# EAGLE design prototype_v02 (EAGLE 5.07)
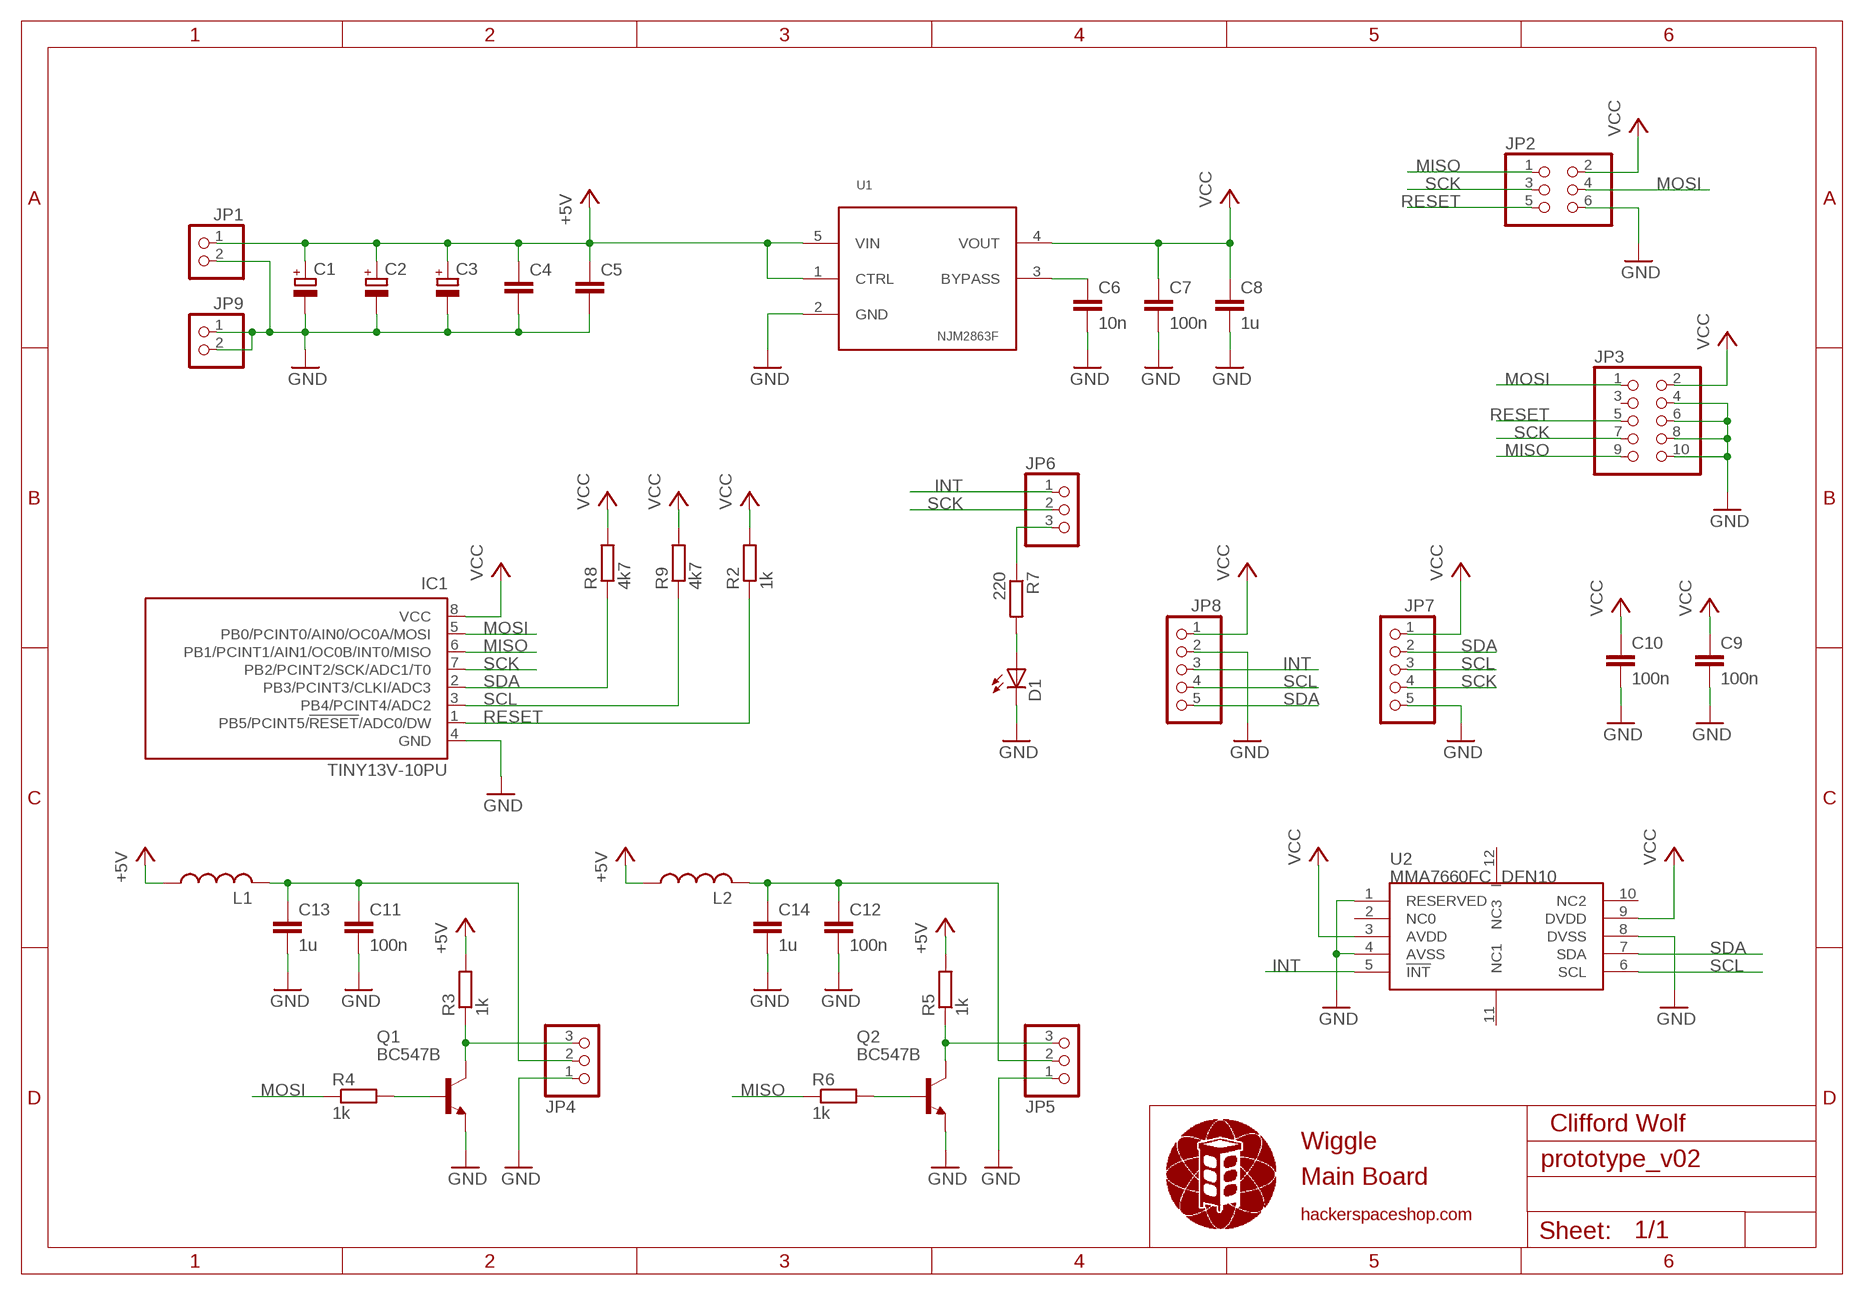
[diagram p0: schematic, sheet 1]

## Parts
C1  CPOLE5-10.5  [E5-10,5]
C2  CPOLE2-5  [E2-5]
C3  CPOLE2-5  [E2-5]
C4  C050-030X075  [C050-030X075]
C5  C050-030X075  [C050-030X075]
C6  10n  C050-030X075  [C050-030X075]
C7  100n  C050-030X075  [C050-030X075]
C8  1u  C050-030X075  [C050-030X075]
C9  100n  C050-030X075  [C050-030X075]
C10  100n  C050-030X075  [C050-030X075]
C11  100n  C050-030X075  [C050-030X075]
C12  100n  C050-030X075  [C050-030X075]
C13  1u  C050-030X075  [C050-030X075]
C14  1u  C050-030X075  [C050-030X075]
D1  LED5MM  [LED5MM]
IC1  TINY13V-10PU  [DIL08]
JP1  PINHD-1X2/90  [1X02/90]
JP2  PINHD-2X3  [2X03]
JP3  TC2050-IDC-NLTC2050-IDC-NL  [TC2050-IDC-NL]
JP4  PINHD-1X3/90  [1X03/90]
JP5  PINHD-1X3/90  [1X03/90]
JP6  PINHD-1X3  [1X03]
JP7  PINHD-1X5  [1X05]
JP8  PINHD-1X5  [1X05]
JP9  PINHD-1X2  [1X02]
L1  L0414/15  [0414/15]
L2  L0414/15  [0414/15]
Q1  BC547B  [TO92]
Q2  BC547B  [TO92]
R2  1k  R0309/10  [0309/10]
R3  1k  R0309/10  [0309/10]
R4  1k  R0309/10  [0309/10]
R5  1k  R0309/10  [0309/10]
R6  1k  R0309/10  [0309/10]
R7  220  R0309/10  [0309/10]
R8  4k7  R0309/10  [0309/10]
R9  4k7  R0309/10  [0309/10]
U1  NJM2863F  [SOT23-5L]
U2  MMA7660FC_DFN10  [DFN10]

## Nets
+5V [pwr]: C1.+ C2.+ C3.+ C4.1 C5.1 JP1.1 L1.1 L2.1 R3.2 R5.2 U1.1(CTRL) U1.5(VIN)
GND [pwr]: C1.- C2.- C3.- C4.2 C5.2 C6.2 C7.2 C8.2 C9.2 C10.2 C11.2 C12.2 C13.2 C14.2 D1.K(C) IC1.4(GND) JP1.2 JP2.6 JP3.4 JP3.6 JP3.8 JP3.10 JP4.1 JP5.1 JP7.5 JP8.2 JP9.1 JP9.2 Q1.1(E) Q2.1(E) U1.2(GND) U2.1(RESERVED) U2.4(AVSS) U2.8(DVSS)
INT: JP6.1 JP8.3 U2.5(!INT)
MISO: IC1.6(PB1/PCINT1/AIN1/OC0B/INT0/MISO) JP2.1 JP3.9 R6.1
MOSI: IC1.5(PB0/PCINT0/AIN0/OC0A/MOSI) JP2.4 JP3.1 R4.1
N$1: JP4.3 Q1.3(C) R3.1
N$2: Q1.2(B) R4.2
N$4: C6.1 U1.3(BYPASS)
N$5: D1.A R7.2
N$6: JP6.3 R7.1
N$7: JP5.3 Q2.3(C) R5.1
N$8 [pwr]: C11.1 C13.1 JP4.2 L1.2
N$9 [pwr]: C12.1 C14.1 JP5.2 L2.2
N$10: Q2.2(B) R6.2
RESET: IC1.1(PB5/PCINT5/!RESET!/ADC0/DW) JP2.5 JP3.5 R2.1
SCK: IC1.7(PB2/PCINT2/SCK/ADC1/T0) JP2.3 JP3.7 JP6.2 JP7.4
SCL: IC1.3(PB4/PCINT4/ADC2) JP7.3 JP8.4 R9.1 U2.6(SCL)
SDA: IC1.2(PB3/PCINT3/CLKI/ADC3) JP7.2 JP8.5 R8.1 U2.7(SDA)
VCC [pwr]: C7.1 C8.1 C9.1 C10.1 IC1.8(VCC) JP2.2 JP3.2 JP7.1 JP8.1 R2.2 R8.2 R9.2 U1.4(VOUT) U2.3(AVDD) U2.9(DVDD)
Unconnected: JP3.3 U2.2(NC0) U2.10(NC2) U2.11(NC1) U2.12(NC3)

## Notes on the sheet
- Clifford Wolf
- Wiggle
- Main Board
- hackerspaceshop.com

## Library data of the parts
C1-C3 = mp_passive:CPOL: POLARIZED CAPACITOR, European symbol
C4-C14 = mp_passive:C: CAPACITOR, European symbol
D1 = mp_diode:LED: LED (5mm)
IC1 = parts:TINY13: 8-bit AVR Microcontroller with 1K Bytes In-System Programmable Flash Source: http://www.atmel.com/dyn/resources/prod_documents/2535S.pdf
JP1 = parts:PINHD-1X2: PIN HEADER
JP2 = parts:PINHD-2X3: PIN HEADER
JP3 = parts:TC2050-IDC-NL: PIN HEADER
JP4-JP6 = mpc_pinhead:PINHD-1X3: PIN HEADER
JP7 JP8 = mpc_pinhead:PINHD-1X5: PIN HEADER
JP9 = mpc_pinhead:PINHD-1X2: PIN HEADER
L1 L2 = mp_passive:L: INDUCTOR, American symbol
Q1 Q2 = mp_transistor:BC547B: NPN Transistor
R2-R9 = mp_passive:R: RESISTOR, European symbol
U1 = parts:NJM2863F
U2 = ICs_v54:MMA7660FC

## Net classes
1 pwr: width 0.254 mm

## Board
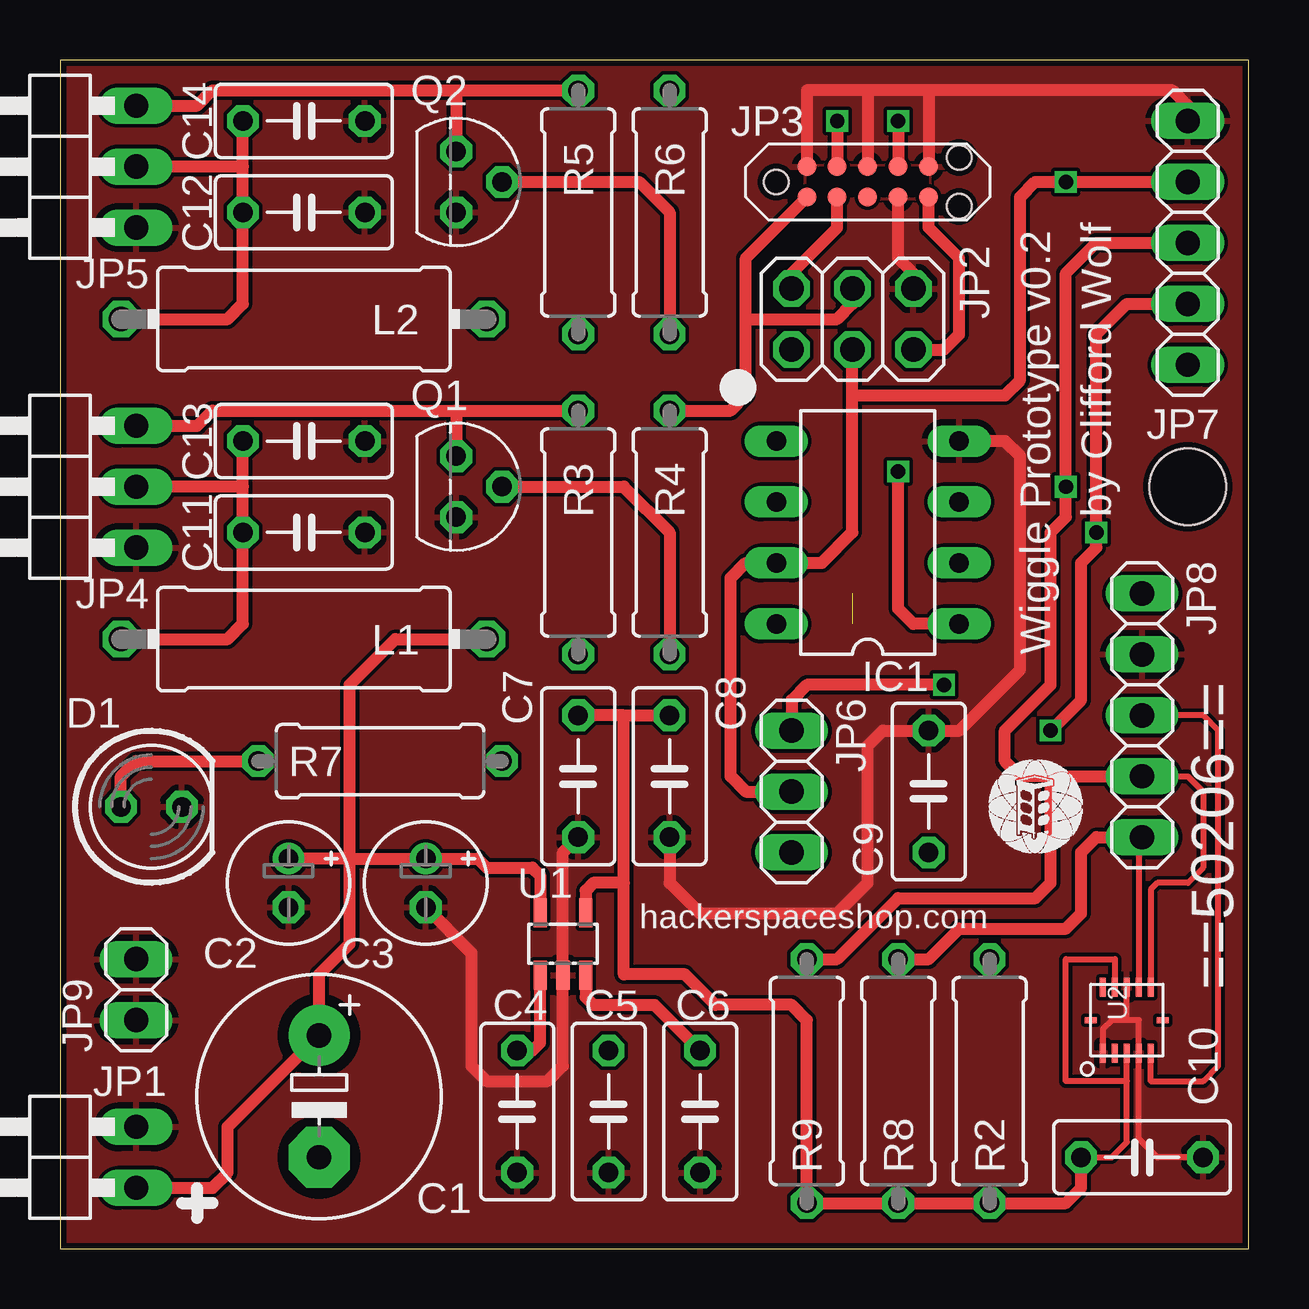
[diagram p1: board, top side]
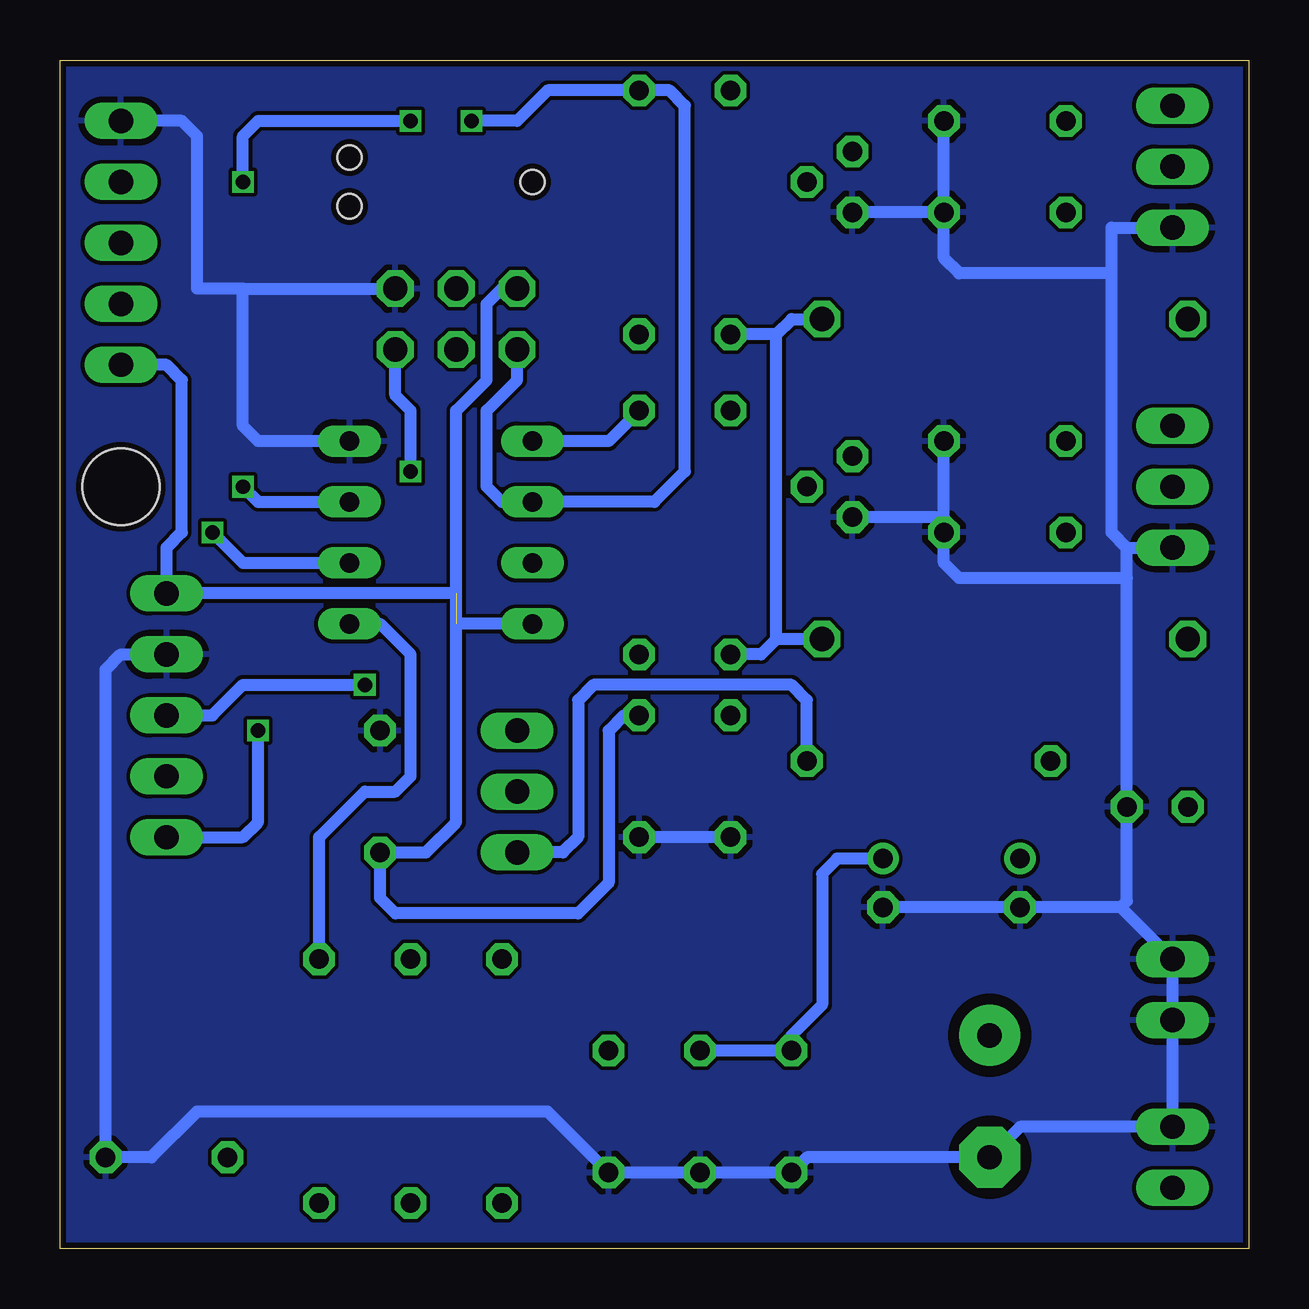
[diagram p2: board, bottom side, seen from below]

Size 49.53 x 49.53 mm. Coordinates in mm from the lower left corner, seen from the top.
Outline: 0,0 49.53,0 49.53,49.53 0,49.53 0,0
Copper layers (1*16): Top 0.035mm / dielectric 1.5mm / Bottom 0.035mm
Design rules "seeed": minimum track width 6mil, minimum drill 12mil, track to track 6mil, track to pad 6mil, pad to pad 6mil, via to via 6mil, smd to smd 0mil, copper to edge 10mil, drill to drill 10mil, minimum pad ring 10mil, minimum via ring 6mil, stop-mask expansion 2mil, vias tented up to drill 100mil, thermal gap 10mil
Holes 3.2 mm at 46.99,31.75
tRestrict: area 9.4,7.5 to 12.2,10.3; area 9.4,2.4 to 12.2,5.2
bRestrict: area 9.4,7.5 to 12.2,10.3; area 9.4,2.4 to 12.2,5.2

### Footprints (pad centres in the part's own frame; a part is rotated, then mirrored left to right if it is on the bottom)
E5-10,5 = drill 1.016 pad 2.54 round: + -2.54,0 | drill 1.016 pad 2.54 octagon: - 2.54,0
E2-5 = drill 0.813 pad 1.27 round: + -1.016,0 | drill 0.813 pad 1.27 octagon: - 1.016,0
C050-030X075 = drill 0.813 octagon: 1 -2.54,0; 2 2.54,0
LED5MM = drill 0.813 octagon: A -1.27,0; K 1.27,0
DIL08 = drill 0.813 long: 1 -3.81,-3.81; 2 -1.27,-3.81; 3 1.27,-3.81; 4 3.81,-3.81; 5 3.81,3.81; 6 1.27,3.81; 7 -1.27,3.81; 8 -3.81,3.81
1X02/90 = drill 1.016 long: 1 -1.27,-3.81; 2 1.27,-3.81
2X03 = drill 1.016 octagon: 1 -2.54,-1.27; 2 -2.54,1.27; 3 0,-1.27; 4 0,1.27; 5 2.54,-1.27; 6 2.54,1.27
TC2050-IDC-NL = smd 0.787 x 0.787: 1 1.27,-0.635; 2 2.54,-0.635; 3 3.81,-0.635; 4 5.08,-0.635; 5 6.35,-0.635; 6 6.35,0.635; 7 5.08,0.635; 8 3.81,0.635; 9 2.54,0.635; 10 1.27,0.635 | hole 1.016: 0,0; 7.62,1.016; 7.62,-1.016
1X03/90 = drill 1.016 long: 1 -2.54,-3.81; 2 0,-3.81; 3 2.54,-3.81
1X03 = drill 1.016 long: 1 -2.54,0; 2 0,0; 3 2.54,0
1X05 = drill 1.016 long: 1 -5.08,0; 2 -2.54,0; 3 0,0; 4 2.54,0; 5 5.08,0
1X02 = drill 1.016 long: 1 -1.27,0; 2 1.27,0
0414/15 = drill 1.016 octagon: 1 -7.62,0; 2 7.62,0
TO92 = drill 0.813 octagon: 1 1.27,0; 2 0,1.905; 3 -1.27,0
0309/10 = drill 0.813 octagon: 1 -5.08,0; 2 5.08,0
SOT23-5L = smd 0.55 x 1.2: 1 -0.95,-1.3; 2 0,-1.3; 3 0.95,-1.3; 4 0.95,1.3; 5 -0.95,1.3
DFN10 = smd 0.8 x 0.25: 1 -1.375,1; 2 -1.375,0.5; 3 -1.375,0; 4 -1.375,-0.5; 5 -1.375,-1; 6 1.375,-1; 7 1.375,-0.5; 8 1.375,0; 9 1.375,0.5; 10 1.375,1 | smd 0.25 x 0.5: 11 0,-1.5; 12 0,1.5

### Placement (x,y rotation side)
C1  10.79,6.35 270 top
C2  9.53,15.24 270 top
C3  15.24,15.24 270 top
C4  19.05,5.71 270 top
C5  22.86,5.71 270 top
C6  26.67,5.71 270 top
C7  21.59,19.68 270 top
C8  25.4,19.68 270 top
C9  36.2,19.05 90 top
C10  45.09,3.81 0 top
C11  10.16,29.84 0 top
C12  10.16,43.18 0 top
C13  10.16,33.66 0 top
C14  10.16,46.99 0 top
D1  3.81,18.41 0 top
IC1  33.66,29.84 90 top
JP1  -0.64,3.81 90 top
JP2  33.02,38.73 0 top
JP3  29.84,44.45 0 top
JP4  -0.64,31.75 90 top
JP5  -0.64,45.09 90 top
JP6  30.48,19.05 270 top
JP7  46.99,41.91 90 top
JP8  45.09,22.23 270 top
JP9  3.17,10.79 90 top
L1  10.16,25.4 180 top
L2  10.16,38.73 180 top
Q1  16.51,31.75 270 top
Q2  16.51,44.45 270 top
R2  38.73,6.99 270 top
R3  21.59,29.84 270 top
R4  25.4,29.84 270 top
R5  21.59,43.18 270 top
R6  25.4,43.18 270 top
R7  13.34,20.32 180 top
R8  34.92,6.99 270 top
R9  31.11,6.99 270 top
U1  20.95,12.7 0 top
U2  44.45,9.53 90 top
U$1  [METALAB]  40.64,18.41 0 top

### Tracks (layer width: path | path; a pad name or v marks a point on that pad's centre or on a via)
+5V
  Top 0.508: JP1.1 6.35,2.54 6.99,3.17 6.99,5.08 C1.+ 10.79,11.43 12.06,12.7 12.06,16.26 | 12.06,16.26 C2.+ | 12.06,16.26 C3.+ 17.4,16.26 17.78,15.88 19.68,15.88 20,15.55 U1.5 | C4.1 19.68,8.26 20,8.57 U1.1 | L1.1 13.97,25.4 12.06,23.5 12.06,16.26
  Bottom 0.508: C3.+ 17.14,16.26 17.78,15.62 17.78,10.16 19.05,8.89 C4.1 C5.1 | 19.68,38.1 R5.2 | L2.1 19.05,38.73 19.68,38.1 | R3.2 20.32,24.77 19.68,25.4 | 19.68,25.4 19.68,38.1 | L1.1 19.68,25.4
GND
  Top 0.254: U2.1 43.45,9.16 43.81,9.53 44.45,9.53 | 44.45,9.53 U2.8 | 44.45,9.53 44.95,9.53 U2.4 44.95,4.58 45.72,3.81 C10.2
  Top 0.508: C3.- 17.14,12.32 17.14,7.62 17.78,6.99 20.32,6.99 20.95,7.62 U1.2 20.95,16.51 C7.2 | C8.2 25.4,15.24 26.67,13.97 32.38,13.97 33.66,15.24 33.66,20.95 34.29,21.59 C9.2 37.47,21.59 40.01,24.13 40.01,33.02 39.37,33.66 IC1.4 | 36.2,48.26 JP3.6 | 36.2,48.26 46.35,48.26 46.99,47.62 JP7.5 | JP3.10 31.11,48.26 33.66,48.26 | 36.2,48.26 33.66,48.26 | 33.66,48.26 JP3.8 | JP3.4 34.92,41.27 35.56,40.64 JP2.6
  Bottom 0.508: 5.33,14.22 JP9.2 JP9.1 JP1.2 9.53,5.08 C1.- 18.41,3.81 C4.2 C5.2 C6.2 29.21,5.71 43.81,5.71 45.72,3.81 C10.2 47.62,24.13 46.99,24.77 JP8.2 | 5.33,14.22 C2.- C3.- | 5.33,14.22 5.08,14.48 D1.K 5.08,27.94 | 5.08,27.94 5.08,29.21 | 5.08,29.21 JP4.1 | 12.7,30.48 Q1.1 | JP5.1 5.71,42.55 5.71,40.64 | 5.08,29.21 5.71,29.84 5.71,40.64 | 5.71,40.64 12.06,40.64 12.7,41.27 C12.2 | C12.2 C14.2 | C12.2 Q2.1 | 5.08,27.94 12.06,27.94 12.7,28.57 C11.2 12.7,30.48 | 12.7,30.48 C13.2 | C7.2 C8.2 | JP7.5 44.45,46.99 43.81,46.35 43.81,40.01 41.91,40.01 | 41.91,40.01 41.91,34.29 41.27,33.66 IC1.4 | 41.91,40.01 JP2.6
  pour Top: 0,49.53 49.53,49.53 49.53,0 0,0
  pour Bottom: 0,49.53 0,0 49.53,0 49.53,49.53
INT  (via drill 0.6)
  Top 0.254: U2.5 45.45,6.99 47.62,6.99 48.26,7.62 48.26,21.59 47.62,22.23 JP8.3
  Top 0.508: v36.83,23.5 31.11,23.5 30.48,22.86 JP6.1
  Bottom 0.508: v36.83,23.5 41.91,23.5 43.18,22.23 JP8.3
MISO  (via drill 0.6)
  Top 0.508: v32.38,46.99 JP3.9
  Bottom 0.508: v32.38,46.99 30.48,46.99 29.21,48.26 R6.1 24.13,48.26 23.5,47.62 23.5,32.38 24.77,31.11 IC1.6 31.11,31.11 31.75,31.75 31.75,34.92 30.48,36.2 JP2.1
MOSI
  Top 0.508: JP2.4 33.02,39.37 32.38,38.73 28.57,38.73 | 28.57,38.73 28.57,41.27 JP3.1 | 28.57,38.73 28.57,35.56 27.94,34.92 R4.1
  Bottom 0.508: IC1.5 26.67,33.66 R4.1
N$1
  Top 0.508: JP4.3 5.71,34.29 6.35,34.92 16.51,34.92 | 16.51,34.92 R3.1 | 16.51,34.92 Q1.3
N$2
  Top 0.508: Q1.2 23.5,31.75 25.4,29.84 R4.2
N$4
  Top 0.508: U1.3 21.91,10.48 22.23,10.16 24.77,10.16 C6.1
N$5
  Top 0.508: D1.A 2.54,19.68 3.17,20.32 R7.2
N$6
  Bottom 0.508: JP6.3 28.57,16.51 27.94,17.14 27.94,22.86 27.3,23.5 19.05,23.5 18.41,22.86 R7.1
N$7
  Top 0.508: JP5.3 5.71,47.62 6.35,48.26 16.51,48.26 | 16.51,48.26 R5.1 | 16.51,48.26 Q2.3
N$8
  Top 0.508: 7.62,31.75 C11.1 7.62,26.04 6.99,25.4 L1.2 | 7.62,31.75 C13.1 | 7.62,31.75 JP4.2
N$9
  Top 0.508: L2.2 6.99,38.73 7.62,39.37 C12.1 7.62,45.09 | 7.62,45.09 C14.1 | 7.62,45.09 JP5.2
N$10
  Top 0.508: Q2.2 24.13,44.45 25.4,43.18 R6.2
RESET  (via drill 0.6)
  Top 0.508: JP3.5 36.2,42.55 37.47,41.27 37.47,38.1 36.83,37.47 JP2.5 | v34.92,32.38 34.92,26.67 35.56,26.04 IC1.1
  Bottom 0.508: R2.1 38.73,17.14 36.83,19.05 35.56,19.05 34.92,19.68 34.92,24.77 36.2,26.04 IC1.1 | JP2.5 35.56,35.56 34.92,34.92 v34.92,32.38
SCK  (via drill 0.6)
  Top 0.508: JP6.2 28.57,19.05 27.94,19.68 27.94,27.94 28.57,28.57 IC1.7 31.75,28.57 33.02,29.84 33.02,35.56 | v34.92,46.99 JP3.7 | JP7.4 v41.91,44.45 40.64,44.45 40.01,43.81 40.01,36.2 39.37,35.56 33.02,35.56 | 33.02,35.56 JP2.3
  Bottom 0.508: v34.92,46.99 41.27,46.99 41.91,46.35 v41.91,44.45
SCL  (via drill 0.6)
  Top 0.254: JP8.4 46.99,19.68 47.62,19.05 47.62,15.88 46.99,15.24 45.72,15.24 45.45,14.97 U2.6
  Top 0.508: R9.1 32.38,12.06 34.92,14.61 40.64,14.61 41.27,15.24 41.27,19.68 | 41.27,19.68 JP8.4 | 41.27,19.68 40.01,19.68 39.37,20.32 39.37,21.59 41.27,23.5 41.27,29.84 41.91,30.48 v41.91,31.75 41.91,40.64 43.18,41.91 JP7.3
  Bottom 0.508: IC1.3 41.27,31.11 v41.91,31.75
SDA  (via drill 0.6)
  Top 0.254: U2.7 44.95,17.01 JP8.5
  Top 0.508: R8.1 36.2,12.06 37.47,13.34 41.91,13.34 42.55,13.97 42.55,16.51 43.18,17.14 JP8.5 | v41.27,21.59 42.55,22.86 42.55,28.57 43.18,29.21 v43.18,29.84 43.18,38.1 44.45,39.37 JP7.2
  Bottom 0.508: IC1.2 41.91,28.57 v43.18,29.84 | v41.27,21.59 41.27,17.78 41.91,17.14 JP8.5
VCC  (1 unrouted)
  Top 0.254: C10.1 43.81,3.81 44.45,4.45 44.45,6.99 | 44.45,6.99 U2.3 | U2.9 43.95,12.06 41.91,12.06 41.91,6.99 44.45,6.99
  Top 0.508: 23.5,22.23 C7.1 | 23.5,22.23 C8.1 | 23.5,15.24 23.5,11.43 26.04,11.43 27.3,10.16 30.48,10.16 31.11,9.53 R9.2 R8.2 R2.2 41.91,1.91 42.55,2.54 C10.1 | 23.5,15.24 23.5,22.23 | U1.4 21.91,14.92 22.23,15.24 23.5,15.24 | JP3.2 32.38,42.55 30.48,40.64 JP2.2
  Bottom 0.508: IC1.8 33.02,26.04 | C8.1 26.04,22.23 26.67,21.59 26.67,15.24 27.94,13.97 35.56,13.97 36.2,14.61 C9.1 34.29,16.51 33.02,17.78 33.02,27.3 | 33.02,27.3 JP8.1 45.09,29.21 44.45,29.84 44.45,36.2 45.09,36.83 JP7.1 | JP2.2 31.11,40.01 31.75,39.37 31.75,36.2 33.02,34.92 33.02,27.3

### Text on the board
tPlace: by Clifford Wolf | Wiggle Prototype v0.2 | hackerspaceshop.com | ==50206==